# EAGLE design MaxAir_Smart_Home_Gateway_WT21-ET01_v202 (EAGLE 9.6.2)
MaxAir - Smart Heating, Ventilation and Air Conditioning (HVAC) Wi-Fi Smart Home Gateway based on MySensors library WT21ETH01 and nRF24L01 PA LNA Note: Power supplied by Barrel Jack connector with minimum 2amp for better performance. Power by micro USB isnt avaialble in this version. For more information on PiHome Smart Heating: http://www.pihome.eu
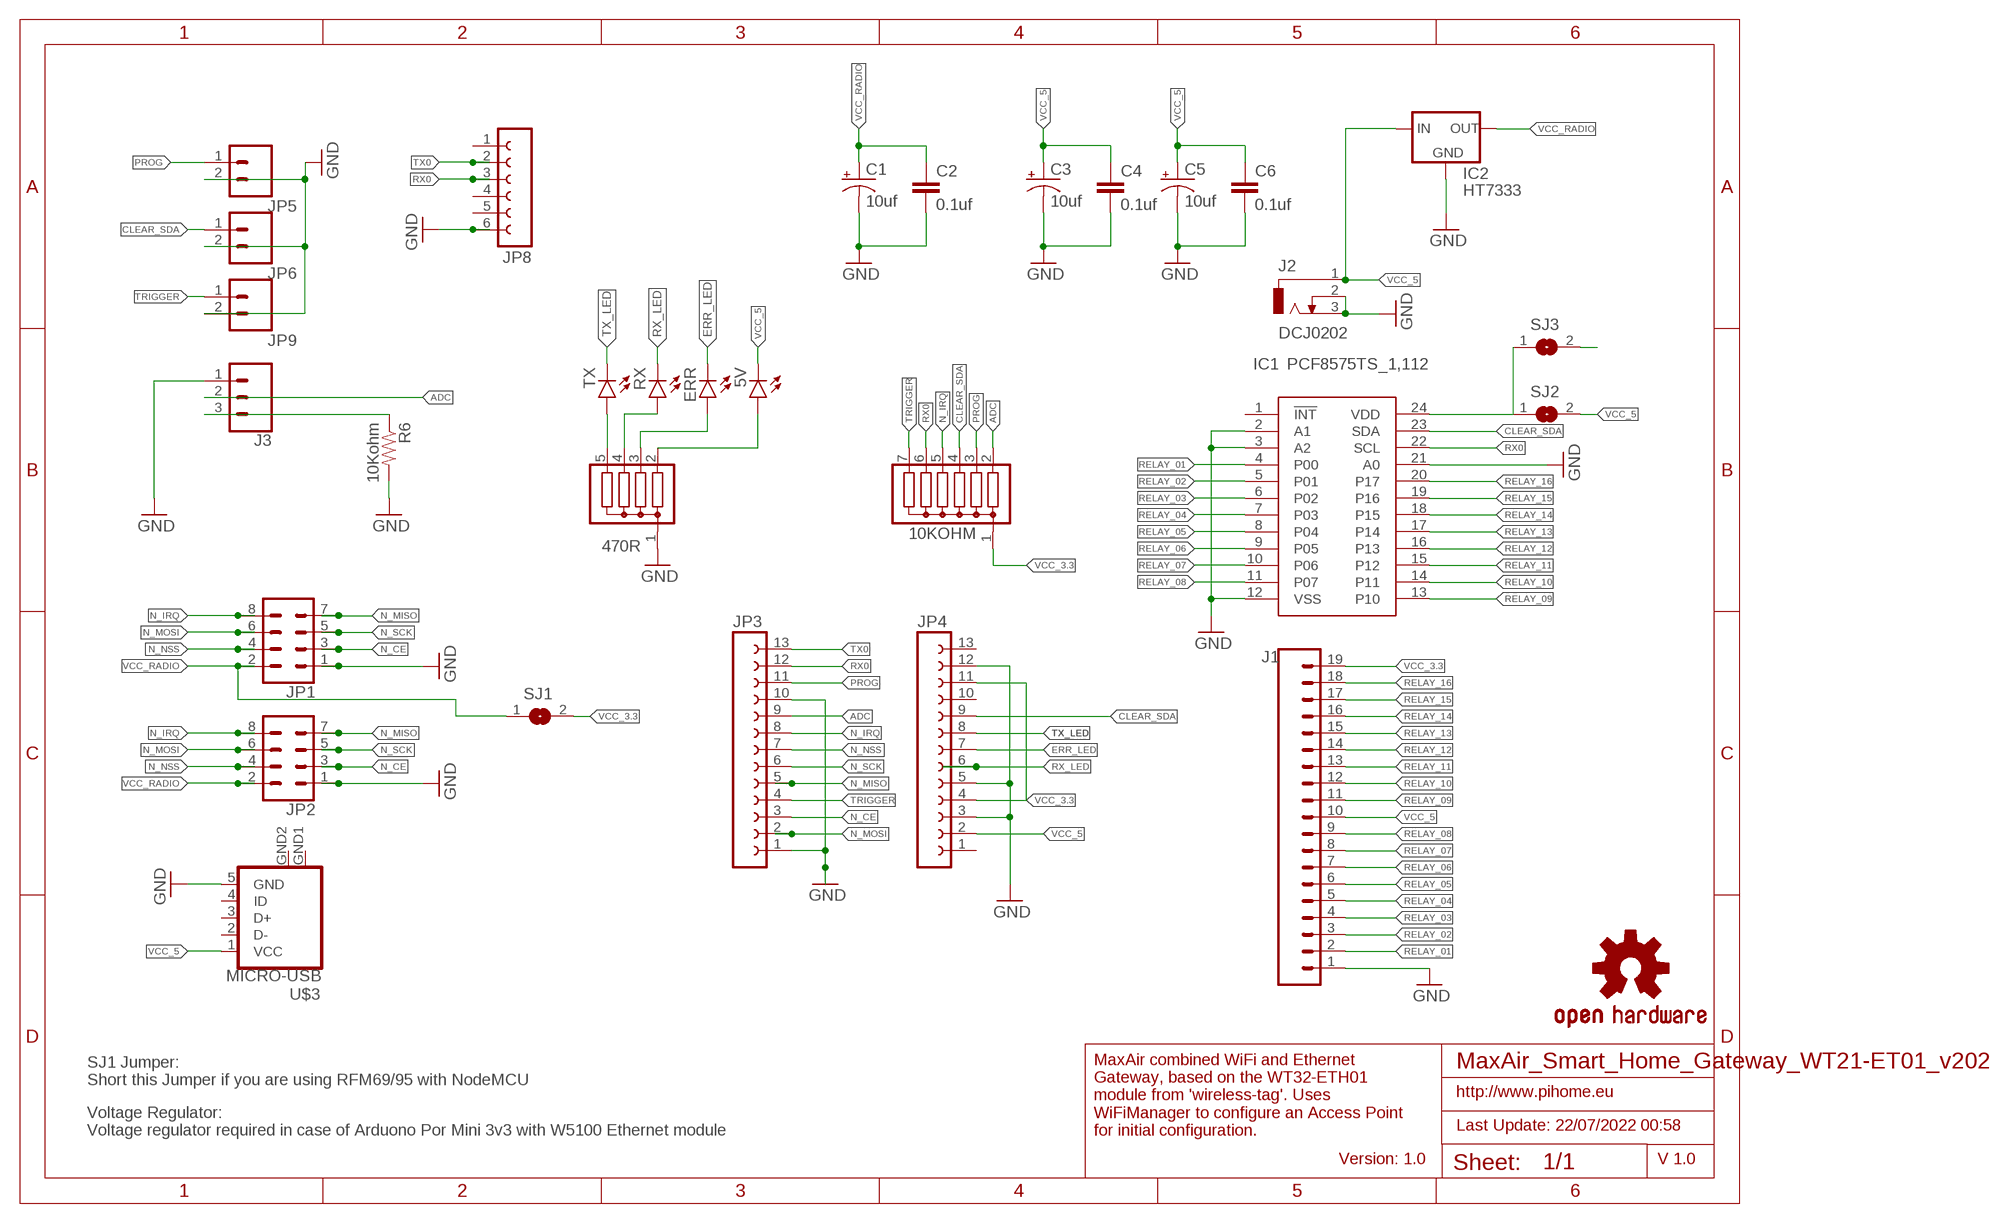
[diagram p0: schematic, sheet 1]

## Parts
5V  LED3MM  [LED3MM]
10KOHM  G06R  [SIL7]
470R  G04R  [SIL5]
C1  10uf  10UF-25V-20%(PTH)KIT  [CPOL-RADIAL-10UF-25V-KIT]
C2  0.1uf  0.1UF-50V-20%(PTH)KIT-EZ  [CAP-PTH-SMALL-KIT]
C3  10uf  10UF-25V-20%(PTH)KIT  [CPOL-RADIAL-10UF-25V-KIT]
C4  0.1uf  0.1UF-50V-20%(PTH)KIT-EZ  [CAP-PTH-SMALL-KIT]
C5  10uf  10UF-25V-20%(PTH)KIT  [CPOL-RADIAL-10UF-25V-KIT]
C6  0.1uf  0.1UF-50V-20%(PTH)KIT-EZ  [CAP-PTH-SMALL-KIT]
ERR  LED3MM  [LED3MM]
IC1  PCF8575TS_1,112  [SOP65P775X200-24N]
IC2  HT7333  [SOT-89]
J1  CONN_19  [1X19]
J2  DCJ0202  [DCJ0202]
J3  CONN_03  [1X03]
JP1  CONN_04X2  [2X4]
JP2  CONN_04X2  [2X4]
JP3  FE13-1  [FE13]
JP4  FE13-1  [FE13]
JP5  CONN_02  [1X02]
JP6  CONN_02  [1X02]
JP8  FE06-1  [FE06]
JP9  CONN_02  [1X02]
LOGO1  OSHW-LOGOMINI  [OSHW-LOGO-MINI]
R6  10Kohm  RESISTORAXIAL-0.3  [AXIAL-0.3]
RX  LED3MM  [LED3MM]
SJ1  SJ  [SJ]
SJ2  SJ  [SJ]
SJ3  SJ  [SJ]
TX  LED3MM  [LED3MM]
U$3  MICRO-USB  [MICRO-USB]

## Nets
8575: IC1.24(VDD) SJ2.1 SJ3.1
ADC: 10KOHM.2 J3.2 JP3.9
CLEAR_SDA: 10KOHM.4 IC1.23(SDA) JP4.9 JP6.1
DIS_ETH: J3.3 R6.P$1
ERR_LED: ERR.K(C) JP4.7
GND: 470R.1 C1.2(-) C2.2 C3.2(-) C4.2 C5.2(-) C6.2 IC1.2(A1) IC1.3(A2) IC1.12(VSS) IC1.21(A0) IC2.2(GND) J1.1 J2.2 J2.3 J3.1 JP1.1 JP2.1 JP3.1 JP3.10 JP4.3 JP4.5 JP4.12 JP5.2 JP6.2 JP8.6 JP9.2 R6.P$2 U$3.5(GND)
N$1: 470R.5 TX.A
N$2: 470R.4 RX.A
N$3: 470R.3 ERR.A
N$4: 5V.A 470R.2
N_CE: JP1.3 JP2.3 JP3.3
N_IRQ: 10KOHM.5 JP1.8 JP2.8 JP3.8
N_MISO: JP1.7 JP2.7 JP3.5
N_MOSI: JP1.6 JP2.6 JP3.2
N_NSS: JP1.4 JP2.4 JP3.7
N_SCK: JP1.5 JP2.5 JP3.6
PROG: 10KOHM.3 JP3.11 JP5.1
RELAY_01: IC1.4(P00) J1.2
RELAY_02: IC1.5(P01) J1.3
RELAY_03: IC1.6(P02) J1.4
RELAY_04: IC1.7(P03) J1.5
RELAY_05: IC1.8(P04) J1.6
RELAY_06: IC1.9(P05) J1.7
RELAY_07: IC1.10(P06) J1.8
RELAY_08: IC1.11(P07) J1.9
RELAY_09: IC1.13(P10) J1.11
RELAY_10: IC1.14(P11) J1.12
RELAY_11: IC1.15(P12) J1.13
RELAY_12: IC1.16(P13) J1.14
RELAY_13: IC1.17(P14) J1.15
RELAY_14: IC1.18(P15) J1.16
RELAY_15: IC1.19(P16) J1.17
RELAY_16: IC1.20(P17) J1.18
RX0: 10KOHM.6 IC1.22(SCL) JP3.12 JP8.3
RX_LED: JP4.6 RX.K(C)
TRIGGER: 10KOHM.7 JP3.4 JP9.1
TX0: JP3.13 JP8.2
TX_LED: JP4.8 TX.K(C)
VCC_3.3: 10KOHM.1 J1.19 JP4.4 JP4.11 SJ1.2 SJ3.2
VCC_5: 5V.K(C) C3.1(+) C4.1 C5.1(+) C6.1 IC2.3(IN) IC2.4(IN) J1.10 J2.1 JP4.2 SJ2.2 U$3.1(VCC)
VCC_RADIO: C1.1(+) C2.1 IC2.1(OUT) JP1.2 JP2.2 SJ1.1
Unconnected: IC1.1(!INT) JP4.1 JP4.10 JP4.13 JP8.1 JP8.4 JP8.5 U$3.2(D-) U$3.3(D+) U$3.4(ID)

## Notes on the sheet
- SJ1 Jumper:
  Short this Jumper if you are using RFM69/95 with NodeMCU
- http://www.pihome.eu
- Last Update: 22/07/2022 00:58
- Voltage Regulator:
  Voltage regulator required in case of Arduono Por Mini 3v3 with W5100 Ethernet module
- MaxAir combined WiFi and Ethernet
  Gateway, based on the WT32-ETH01
  module from 'wireless-tag'. Uses
  WiFiManager to configure an Access Point
  for initial configuration.
- Version: 1.0 | V 1.0

## Power pins joined to a net without a drawn wire
GND: U$3.GND1(GND) U$3.GND2(GND)

## Library data of the parts
5V ERR RX TX = SparkFun-LED:LED: LEDs Standard schematic elements and footprints for 5mm, 3mm, 1206, and 0603 sized LEDs. 5mm - Spark Fun Electronics SKU : COM-00529 (and others); PROD_ID: DIO-08794
10KOHM = resistor-sil:G06R: SIL RESISTOR; OC_FARNELL: unknown; OC_NEWARK: unknown
470R = resistor-sil:G04R: SIL RESISTOR; OC_FARNELL: unknown; OC_NEWARK: unknown
C1 C3 C5 = SparkFun-Capacitors:10UF-25V-20%(PTH): CAP-08440; PROD_ID: CAP-08440
C2 C4 C6 = SparkFun-Capacitors:0.1UF-50V-20%(PTH): CAP-08370; PROD_ID: CAP-08370
IC1 = PCF8575TS_1_112:PCF8575TS_1,112: I2C bus 16-bit I/O expander,PCF8575TSF1 NXP PCF8575TS/1,112, 16-channel I/O Expander 400kHz, I2C, 24-Pin SSOP Source: Datasheet <http://www.nxp.com/docs/en/data-sheet/PCF8575C.pdf>; ARROW_PART_NUMBER: PCF8575TS/1,112; ARROW_PRICE-STOCK: https://www.arrow.com/en/products/pcf8575ts1112/nxp-semiconductors?region=nac; DESCRIPTION: I2C bus 16-bit I/O expander,PCF8575TSF1 NXP PCF8575TS/1,112, 16-channel I/O Expander 400kHz, I2C, 24-Pin SSOP; HEIGHT: 2mm; MANUFACTURER_NAME: NXP; MANUFACTURER_PART_NUMBER: PCF8575TS/1,112; MOUSER_PART_NUMBER: 771-PCF8575TSDB; MOUSER_PRICE-STOCK: https://www.mouser.co.uk/ProductDetail/NXP-Semiconductors/PCF8575TS-1112?qs=LOCUfHb8d9vJzKldbVRCSg%3D%3D
IC2 = holtek2:HT73*
J1 = SparkFun-Connectors:CONN_19: Multi connection point. Often used as Generic Header-pin footprint for 0.1 inch spaced/style header connections On any of the 0.1 inch spaced packages, you can populate with these: Break Away Headers - Straight <https://www.sparkfun.com/products/116> (PRT-00116) Break Away Male Headers - Right Angle <https://www.sparkfun.com/products/553> (PRT-00553) Female Headers <https://www.sparkfun.com/products/115> (PRT-00115) Break Away Headers - Machine Pin <https://www.sparkfun.com/products/117> (PRT-00117) Break Away Female Headers - Swiss Machine Pin <https://www.sparkfun.com/products/743> (PRT-00743) For SCREWTERMINALS and SPRING TERMINALS visit here: Screw Terimnals on SparkFun.com <https://www.sparkfun.com/search/results?term=Screw+Terminals> (5mm/3.5mm/2.54mm spacing) This device is also useful as a general connection point to wire up your design to another part of your project. Our various solder wires solder well into these plated through hole pads. Hook-Up Wire - Assortment (Stranded, 22 AWG) <https://www.sparkfun.com/products/11375> (PRT-11375) Hook-Up Wire - Assortment (Solid Core, 22 AWG) <https://www.sparkfun.com/products/11367> (PRT-11367) View the entire wire category on our website here <https://www.sparkfun.com/categories/141> Special notes: Molex polarized connector foot print use with SKU : PRT-08231 with associated crimp pins and housings. 1MM SMD Version SKU: PRT-10208 NOTES ON THE VARIANTS LOCK and LOCK_LONGPADS... This footprint was designed to help hold the alignment of a through-hole component (i.e. 6-pin header) while soldering it into place. You may notice that each hole has been shifted either up or down by 0.005 of an inch from it's more standard position (which is a perfectly straight line). This slight alteration caused the pins (the squares in the middle) to touch the edges of the holes. Because they are alternating, it causes a "brace" to hold the component in place. 0.005 has proven to be the perfect amount of "off-center" position when using our standard breakaway headers. Although looks a little odd when you look at the bare footprint, once you have a header in there, the alteration is very hard to notice. Also,if you push a header all the way into place, it is covered up entirely on the bottom side.
J2 = con-jack:DCJ0202: DC POWER JACK Source: DCJ0202.pdf; OC_FARNELL: unknown; OC_NEWARK: unknown
J3 = SparkFun-Connectors:CONN_03: Multi connection point. Often used as Generic Header-pin footprint for 0.1 inch spaced/style header connections On any of the 0.1 inch spaced packages, you can populate with these: Break Away Headers - Straight <https://www.sparkfun.com/products/116> (PRT-00116) Break Away Male Headers - Right Angle <https://www.sparkfun.com/products/553> (PRT-00553) Female Headers <https://www.sparkfun.com/products/115> (PRT-00115) Break Away Headers - Machine Pin <https://www.sparkfun.com/products/117> (PRT-00117) Break Away Female Headers - Swiss Machine Pin <https://www.sparkfun.com/products/743> (PRT-00743) Stackable Header - 3 Pin (Female, 0.1") <https://www.sparkfun.com/products/13875> (PRT-13875) For SCREWTERMINALS and SPRING TERMINALS visit here: Screw Terimnals on SparkFun.com <https://www.sparkfun.com/search/results?term=Screw+Terminals> (5mm/3.5mm/2.54mm spacing) This device is also useful as a general connection point to wire up your design to another part of your project. Our various solder wires solder well into these plated through hole pads. Hook-Up Wire - Assortment (Stranded, 22 AWG) <https://www.sparkfun.com/products/11375> (PRT-11375) Hook-Up Wire - Assortment (Solid Core, 22 AWG) <https://www.sparkfun.com/products/11367> (PRT-11367) View the entire wire category on our website here <https://www.sparkfun.com/categories/141> Special notes: Molex polarized connector foot print use with SKU : PRT-08232 with associated crimp pins and housings.
JP1 JP2 = SparkFun-Connectors:CONN_04X2: Multi connection point. Often used as Generic Header-pin footprint for 0.1 inch spaced/style header connections On any of the 0.1 inch spaced packages, you can populate with these: Break Away Headers - Straight <https://www.sparkfun.com/products/116> (PRT-00116) Break Away Male Headers - Right Angle <https://www.sparkfun.com/products/553> (PRT-00553) Female Headers <https://www.sparkfun.com/products/115> (PRT-00115) Break Away Headers - Machine Pin <https://www.sparkfun.com/products/117> (PRT-00117) Break Away Female Headers - Swiss Machine Pin <https://www.sparkfun.com/products/743> (PRT-00743)
JP3 JP4 = con-lsta:FE13-1: FEMALE HEADER; OC_FARNELL: unknown; OC_NEWARK: unknown
JP5 JP6 JP9 = SparkFun-Connectors:CONN_02: Multi connection point. Often used as Generic Header-pin footprint for 0.1 inch spaced/style header connections On any of the 0.1 inch spaced packages, you can populate with these: Break Away Headers - Straight <https://www.sparkfun.com/products/116> (PRT-00116) Break Away Male Headers - Right Angle <https://www.sparkfun.com/products/553> (PRT-00553) Female Headers <https://www.sparkfun.com/products/115> (PRT-00115) Break Away Headers - Machine Pin <https://www.sparkfun.com/products/117> (PRT-00117) Break Away Female Headers - Swiss Machine Pin <https://www.sparkfun.com/products/743> (PRT-00743) For SCREWTERMINALS and SPRING TERMINALS visit here: Screw Terimnals on SparkFun.com <https://www.sparkfun.com/search/results?term=Screw+Terminals> (5mm/3.5mm/2.54mm spacing) This device is also useful as a general connection point to wire up your design to another part of your project. Our various solder wires solder well into these plated through hole pads. Hook-Up Wire - Assortment (Stranded, 22 AWG) <https://www.sparkfun.com/products/11375> (PRT-11375) Hook-Up Wire - Assortment (Solid Core, 22 AWG) <https://www.sparkfun.com/products/11367> (PRT-11367) View the entire wire category on our website here <https://www.sparkfun.com/categories/141> Special notes: Molex polarized connector foot print use with: PRT-08233 with associated crimp pins and housings. 2.54_SCREWTERM for use with PRT-10571. 3.5mm Screw Terminal footprints for PRT-08084 5mm Screw Terminal footprints for use with PRT-08432
JP8 = con-lsta:FE06-1: FEMALE HEADER; OC_FARNELL: unknown; OC_NEWARK: unknown
LOGO1 = SparkFun-Aesthetics@1:OSHW-LOGO: Open-Source Hardware (OSHW) Logo This logo indicates the piece of hardware it is found on incorporates a OSHW license and/or adheres to the definition of open source hardware found here: http://freedomdefined.org/OSHW
R6 = SparkFun-Passives:RESISTOR: Resistor Basic schematic elements and footprints for 0603, 1206, and PTH resistors.
SJ1-SJ3 = jumper:SJ: SMD solder JUMPER
U$3 = microusb:MICRO-USB: Micro USB B connector

## Net classes
0 default: width 0.254 mm, drill 0.076 mm, clearance 0.205 mm

## Board
MaxAir - Smart Heating, Ventilation and Air Conditioning (HVAC) Wi-Fi Smart Home Gateway based on MySensors library WT21ETH01 and nRF24L01 PA LNA Note: Power supplied by Barrel Jack connector with minimum 2amp for better performance. Power by micro USB isnt avaialble in this version. For more information on PiHome Smart Heating: http://www.pihome.eu
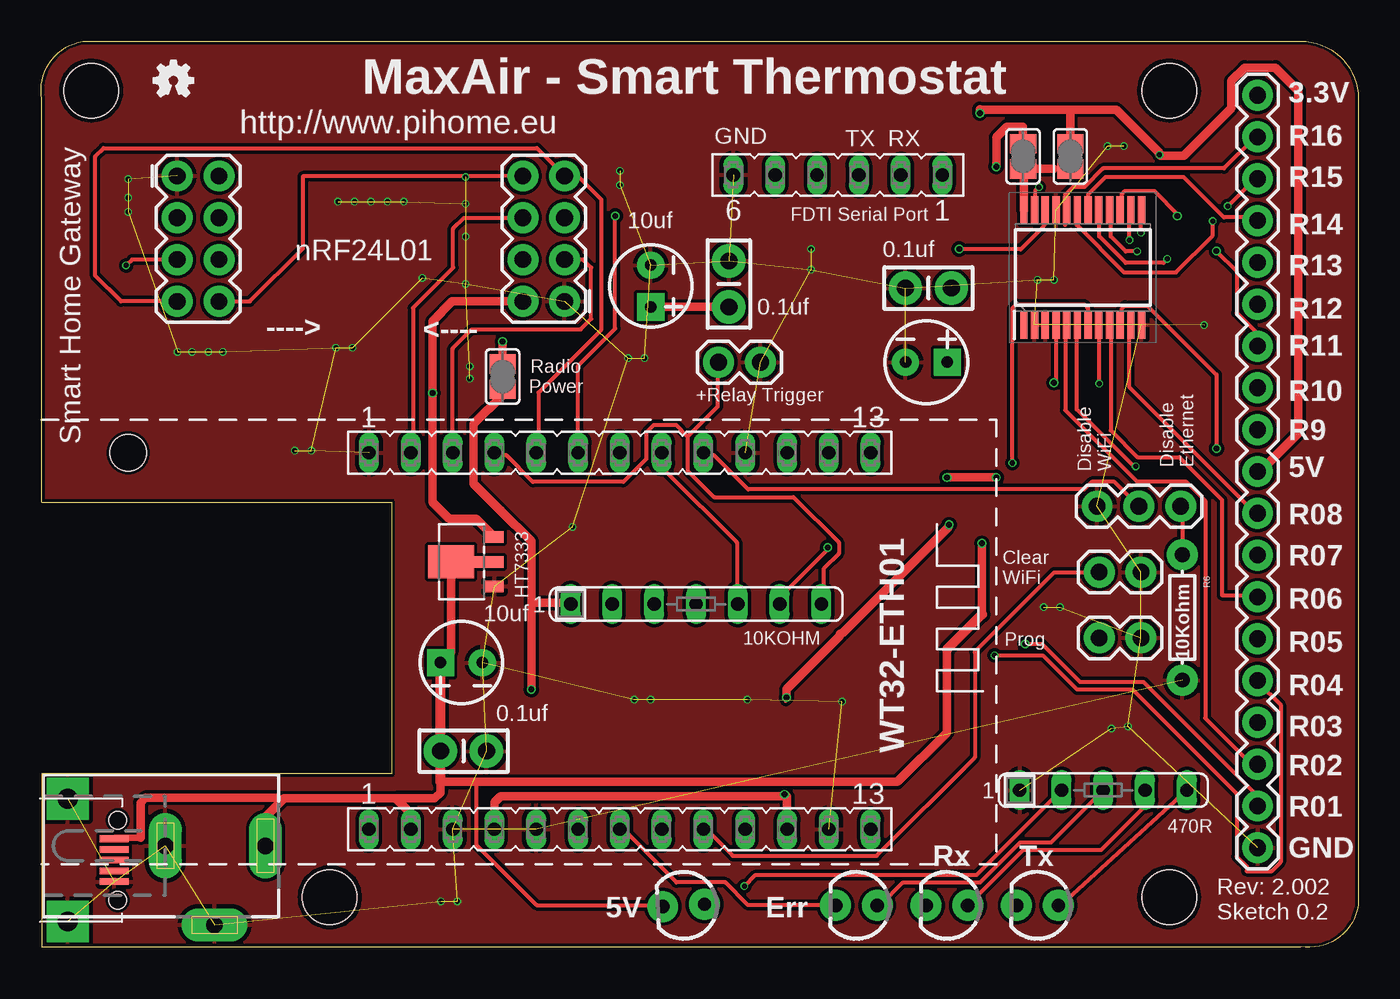
[diagram p1: board, top side]
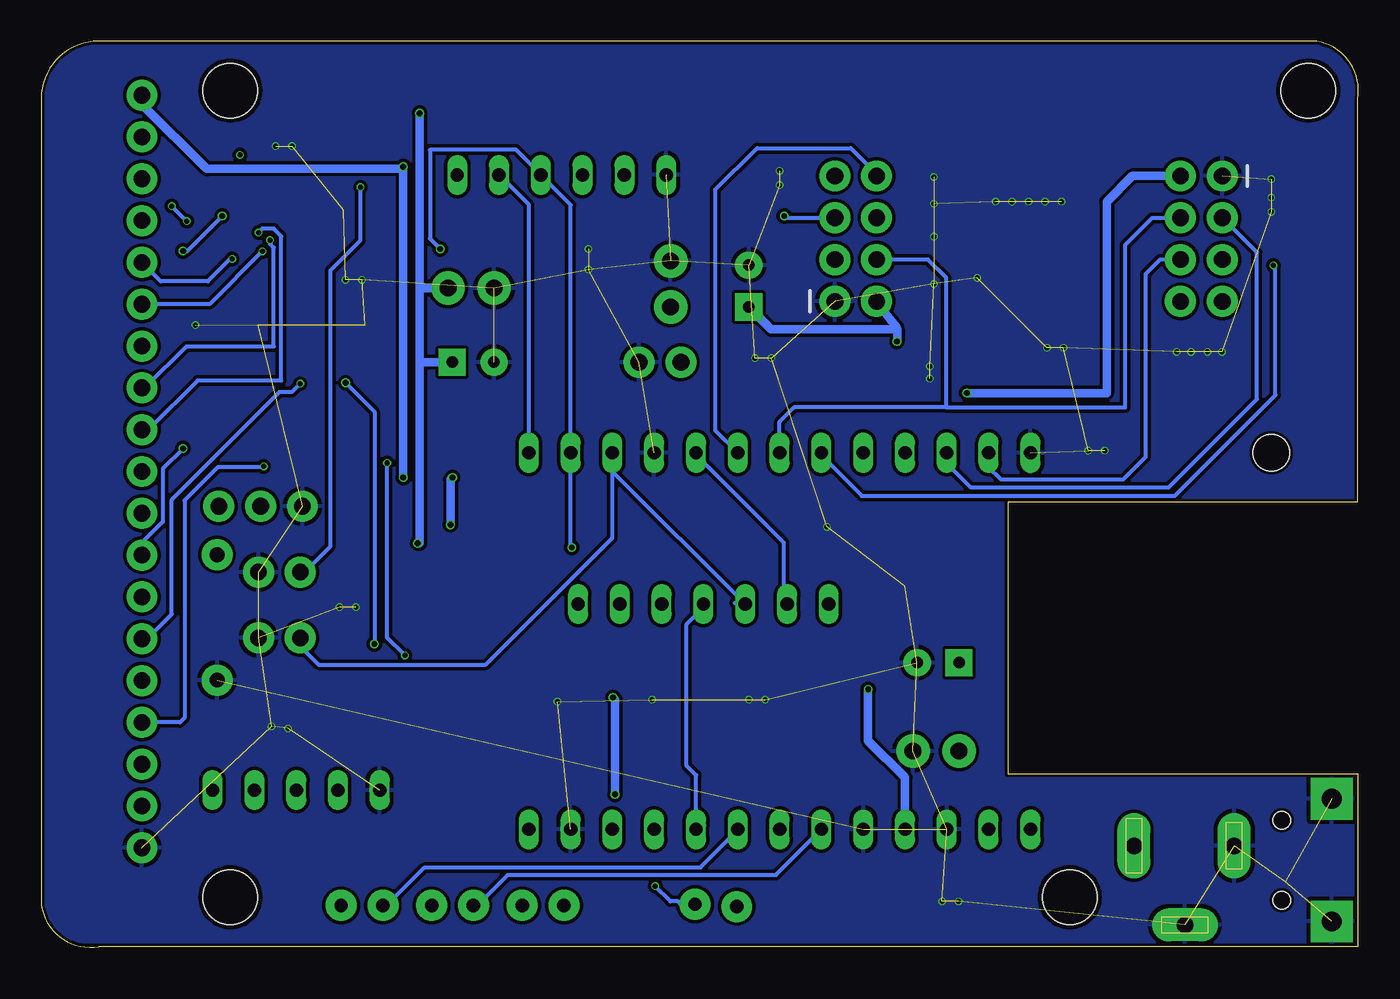
[diagram p2: board, bottom side, seen from below]

Size 80.04 x 55.04 mm. Coordinates in mm from the lower left corner, seen from the top.
Outline: 0.04,0.04 76.54,0.04 arc90 80.04,2.54 80.04,51.54 arc90 76.54,55.04 2.54,55.04 arc90 0.04,51.54 0.04,27.04 21.29,27.04 21.29,10.54 0.04,10.54 0.04,0.04
Copper layers (1*16): Top 0.035559375mm / dielectric 1.6mm / Bottom 0.035559375mm
Design rules "PiHome - JLCPCB 2 Layer": minimum track width 5mil, minimum drill 12mil, track to track 5mil, track to pad 5mil, pad to pad 5mil, via to via 5mil, smd to smd 5mil, copper to edge 8mil, drill to drill 6mil, minimum pad ring 5mil, minimum via ring 3mil, stop-mask expansion 2.5mil, vias tented up to drill 0mil, thermal gap 10mil
Holes 2.2 mm at 5.29,30.04

### Footprints (pad centres in the part's own frame; a part is rotated, then mirrored left to right if it is on the bottom)
LED3MM = drill 0.813 pad 1.88: A -1.27,0; K 1.27,0
SIL7 = drill 0.813 long: 1 -7.62,0; 2 -5.08,0; 3 -2.54,0; 4 0,0; 5 2.54,0; 6 5.08,0; 7 7.62,0
SIL5 = drill 0.813 long: 1 -5.08,0; 2 -2.54,0; 3 0,0; 4 2.54,0; 5 5.08,0
CPOL-RADIAL-10UF-25V-KIT = drill 0.7 pad 1.651 square: 1 1.27,0 | drill 0.7 pad 1.651: 2 -1.27,0
CAP-PTH-SMALL-KIT = drill 1.016 pad 2.032: 1 -1.397,0; 2 1.397,0
SOP65P775X200-24N = smd 1.675 x 0.45: 1 -3.488,3.575; 2 -3.488,2.925; 3 -3.488,2.275; 4 -3.488,1.625; 5 -3.488,0.975; 6 -3.488,0.325; 7 -3.488,-0.325; 8 -3.488,-0.975; 9 -3.488,-1.625; 10 -3.488,-2.275; 11 -3.488,-2.925; 12 -3.488,-3.575; 13 3.488,-3.575; 14 3.488,-2.925; 15 3.488,-2.275; 16 3.488,-1.625; 17 3.488,-0.975; 18 3.488,-0.325; 19 3.488,0.325; 20 3.488,0.975; 21 3.488,1.625; 22 3.488,2.275; 23 3.488,2.925; 24 3.488,3.575
SOT-89 = smd 0.7 x 1.1: 1 1.5,-2.385; 2 -1.5,-2.385 | smd 0.7 x 1.8: 3 0,-2.035 | smd 2 x 2.8: 4 0,0.265
1X19 = drill 1.016 pad 1.88: 1 0,0; 2 2.54,0; 3 5.08,0; 4 7.62,0; 5 10.16,0; 6 12.7,0; 7 15.24,0; 8 17.78,0; 9 20.32,0; 10 22.86,0; 11 25.4,0; 12 27.94,0; 13 30.48,0; 14 33.02,0; 15 35.56,0; 16 38.1,0; 17 40.64,0; 18 43.18,0; 19 45.72,0
DCJ0202 = drill 1 pad 2 long: 1 0,3.1; 2 4.8,0; 3 0,-3
1X03 = drill 1.016 pad 1.88: 1 0,0; 2 2.54,0; 3 5.08,0
2X4 = drill 1.016 pad 1.88: 1 -3.81,-1.27; 2 -3.81,1.27; 3 -1.27,-1.27; 4 -1.27,1.27; 5 1.27,-1.27; 6 1.27,1.27; 7 3.81,-1.27; 8 3.81,1.27
FE13 = drill 0.813 long: 1 -15.24,0; 2 -12.7,0; 3 -10.16,0; 4 -7.62,0; 5 -5.08,0; 6 -2.54,0; 7 0,0; 8 2.54,0; 9 5.08,0; 10 7.62,0; 11 10.16,0; 12 12.7,0; 13 15.24,0
1X02 = drill 1.016 pad 1.88: 1 0,0; 2 2.54,0
FE06 = drill 0.813 long: 1 -6.35,0; 2 -3.81,0; 3 -1.27,0; 4 1.27,0; 5 3.81,0; 6 6.35,0
AXIAL-0.3 = drill 0.9 pad 1.88: P$1 -3.81,0; P$2 3.81,0
SJ = smd 1.168 x 1.6: 1 -0.762,0; 2 0.762,0
STAND-OFF = hole 3.302: 0,0
MICRO-USB = smd 0.4 x 1.75: 1 -1.3,4.525; 2 -0.65,4.525; 3 0,4.525; 4 0.65,4.525; 5 1.3,4.525 | drill 1.2 pad 2.54 square: GND1 -3.725,1.7; GND2 3.725,1.7 | hole 1.05: -2.425,4.73; 2.425,4.73

### Placement (x,y rotation side)
5V  39.04,2.54 183.3 top
10KOHM  39.8,20.84 0 top
470R  64.54,9.54 0 top
C1  37.04,40.17 270 top
C2  41.79,40.29 90 top
C3  25.54,17.29 180 top
C4  25.67,11.92 0 top
C5  53.79,35.54 0 top
C6  53.92,40.04 180 top
ERR  49.54,2.54 180 top
IC1  63.29,41.29 90 top
IC2  25.17,23.42 90 top
J1  73.92,6.04 90 top
J2  10.54,6.17 270 top
J3  64.17,26.79 0 top
JP1  30.54,43.04 90 top
JP2  9.54,43.04 270 top
JP3  35.17,30.04 0 top
JP4  35.17,7.17 0 top
JP5  64.29,18.79 0 top
JP6  64.29,22.79 0 top
JP8  48.42,46.92 180 top
JP9  41.17,35.54 0 top
LOGO1  8.04,52.67 0 top
R6  69.35,20.04 270 top
RX  55.04,2.54 180 top
SJ1  28.04,34.67 270 top
SJ2  62.54,48.04 90 top
SJ3  59.67,48.04 90 top
TX  60.54,2.54 180 top
U$1  [STAND-OFF]  3.04,52.04 0 top
U$2  [STAND-OFF]  17.54,3.04 0 top
U$3  -0.08,5.29 270 top
U$4  [STAND-OFF]  68.54,52.04 0 top
U$5  [STAND-OFF]  68.54,3.04 0 top

### Tracks (layer width: path | path; a pad name or v marks a point on that pad's centre or on a via)
8575
  Top 0.254: SJ2.1 62.46,47.32 61.78,47.32 61.53,47.28
  Top 0.508: IC1.24 59.72,47.23 SJ3.1 61.53,47.28 61.54,47.29
ADC
  Top 0.254: J3.2 66.6,26.89 65.22,28.27 63.84,28.27 63.38,27.81 42.96,27.81 40.89,29.88 40.43,29.88 JP3.9 40.43,30.1
  Bottom 0.254: 10KOHM.2 34.92,20.92 34.92,24.6 40.2,29.88 JP3.9
CLEAR_SDA  (via drill 0.3)
  Top 0.254: v60.63,46.17 60.4,45.94 60.4,44.79 IC1.23 | JP4.9 40.43,7.15 42.04,5.55 50.76,5.55 56.73,11.52 56.73,17.94 61.55,22.76 64.07,22.76 JP6.1
  Bottom 0.254: 39.74,7.38 40.2,7.38 JP4.9 40.25,10.45 40.81,11.01 40.81,19.63 39.74,20.7 10KOHM.4 | v60.63,46.17 60.63,42.96 62.46,41.12 62.46,24.37 64.07,22.76 JP6.1
DIS_ETH
  Top 0.254: J3.3 69.35,26.68 R6.P$1
ERR_LED
  Top 0.254: JP4.7 35.38,7.15 38.6,3.94 41.58,3.94 42.96,2.57 48.24,2.57 ERR.K
GND  (via drill 0.3)  (75 unrouted)
  other vias: 8.29,36.17 9.17,36.17 10.17,36.17 11.04,36.17 18.92,36.42 17.92,36.42 26.04,34.54 26.04,35.29 15.42,30.17 16.42,30.17 5.29,46.67 5.29,45.54 5.29,44.67 32.29,25.54 48.67,14.92 42.92,15.04 61.92,20.67 60.92,20.67 46.79,42.42 46.79,41.17 22.04,45.29 18.04,45.29 19.04,45.29 20.04,45.29 21.04,45.29 35.67,35.79 36.67,35.79 24.29,2.79 25.29,2.79 25.79,40.29 25.79,43.17 23.17,40.67 25.79,45.17 25.79,46.79 35.17,47.17 35.17,46.29 61.54,40.54 60.54,40.54 66.04,13.42 65.04,13.29 70.67,37.79 64.79,48.67 65.79,48.67 36.04,15.04 37.04,15.04
  pour Top: 0.29,0.29 0.29,10.29 21.54,10.29 21.54,27.29 0.29,27.29 0.29,54.79 79.79,54.79 79.79,0.29
  pour Bottom: 0.29,0.29 79.79,0.29 79.79,54.79 0.29,54.79 0.29,27.29 21.54,27.29 21.54,10.29 0.29,10.29
N$1
  Top 0.254: 470R.5 62.01,2.59 62.01,2.57 TX.A
N$2
  Top 0.254: RX.A 59.69,5.92 64.42,5.92 67.08,8.58 470R.4
N$3
  Top 0.254: ERR.A 50.99,2.57 52.37,3.94 57.06,3.94 59.5,6.37 61.37,6.37 470R.3
N$4  (via drill 0.3)
  Top 0.254: v42.73,3.71 43.42,4.4 56.86,4.4 470R.2
  Bottom 0.254: v42.73,3.71 41.81,2.79 41.35,2.79 41.12,2.57 40.43,2.57 5V.A
N_CE
  Top 0.254: JP3.3 25.01,36.38 26.17,37.54 32.79,37.54 33.42,38.17 33.42,41.29 32.94,41.77 JP1.3
  Bottom 0.254: JP3.3 25.01,29.38 23.54,27.92 11.54,27.92 6.17,33.29 6.17,42.21 JP2.3
N_IRQ
  Top 0.254: JP2.8 12.69,39.23 15.92,42.46 15.92,46.83 28,46.83 JP1.8 | 10KOHM.5 42.27,20.92 42.27,24.6 37.91,28.96 37.91,29.88 JP3.8
  Bottom 0.254: JP1.8 29.27,46.98 30.84,48.54 36.54,48.54 39.08,46 39.08,31.42 JP3.8
N_MISO
  Top 0.254: JP3.5 30.21,30.17 30.21,33.69 34.04,37.52 34.04,45.42 32.61,46.85 JP1.7 30.12,48.54 3.79,48.54 3.29,48.04 3.29,40.79 4.85,39.23 JP2.7
N_MOSI
  Top 0.254: 22.54,30.04 JP3.2 22.59,30.17 22.59,38.84 25.04,41.29 25.04,43.67 25.69,44.31 JP1.6
  Bottom 0.254: JP2.6 12.06,41.77 12.94,40.9 12.94,29.77 14.29,28.42 21.72,28.42 22.47,29.17 JP3.2
N_NSS
  Bottom 0.254: JP3.7 35.17,31.92 34.29,32.79 25.04,32.79 | 25.04,32.79 25.04,40.67 26.15,41.77 JP1.4 | JP2.4 12.52,44.31 14.17,42.67 14.17,32.79 25.04,32.79
N_SCK  (via drill 0.3, 0.35)
  Top 0.254: JP2.5 5.52,41.77 v5.17,41.42 | JP3.6 32.63,35.33 34.87,37.58 v34.87,44.42 v34.88,44.42
  Bottom 0.254: v5.17,41.42 5.04,41.42 5.04,33.54 11.17,27.42 30.17,27.42 32.63,29.88 JP3.6 | v34.88,44.42 34.78,44.31 JP1.5
PROG
  Bottom 0.254: 45.25,29.96 JP3.11 45.33,24.87 53.03,17.17 63.17,17.17 64.29,18.29 JP5.1 | 45.25,29.96 44.95,29.66 | 37.91,20.92 37.45,20.92 10KOHM.3 45.25,28.83 45.25,29.96
RELAY_01  (via drill 0.35)
  Top 0.254: v59.79,18.42 60.84,18.42 63.13,16.12 66.97,16.12 73.92,9.18 J1.2 | IC1.4 61.67,34.42 v61.54,34.29
  Bottom 0.254: v59.79,18.42 59.79,32.54 v61.54,34.29
RELAY_02
  Top 0.254: IC1.5 62.23,37.68 62.23,32.63 66.6,28.27 69.58,28.27 70.73,27.12 70.73,13.93 73.53,11.12 J1.3
RELAY_03  (via drill 0.3)
  Top 0.254: v66.51,29.21 66.39,29.21 62.92,32.67 62.92,37.68 IC1.6
  Bottom 0.254: v66.51,29.21 66.53,29.19 69.29,29.19 71.33,27.14 71.33,13.94 71.61,13.66 J1.4
RELAY_04  (via drill 0.3)
  Top 0.254: IC1.7 63.61,37.91 63.61,38.83 63.38,39.06 59.25,39.06 59.02,38.82 v59.02,29.42 | J1.5 73.94,16.11 75.32,14.73 75.32,5.17 74.77,4.63 73.25,4.63 73.25,4.91 72.64,5.51 72.64,9.31 66.29,15.66 62.94,15.66 60.87,17.73 v57.94,17.73
  Bottom 0.254: v57.94,17.73 59.04,18.83 59.04,29.4 v59.02,29.42
RELAY_05  (via drill 0.3)
  Top 0.254: v64.3,34.24 64.3,37.68 IC1.8
  Bottom 0.254: v64.3,34.24 64.8,33.74 65.55,33.74 72.1,27.18 72.1,20.24 73.48,18.86 73.71,18.86 J1.6
RELAY_06
  Top 0.254: IC1.9 64.99,37.68 64.99,31.4 66.62,29.77 69.16,29.77 71.75,27.18 71.75,21.38 73.71,21.38 J1.7
RELAY_07  (via drill 0.35)
  Top 0.254: 65.66,37.71 IC1.10 65.66,37.9 65.66,38.78 65.85,38.97 67.23,38.97 71.42,34.78 v71.42,30.29
  Bottom 0.254: v71.42,30.29 72.64,29.06 72.64,25.83 73.92,24.56 J1.8
RELAY_08
  Top 0.254: IC1.11 66.14,37.68 66.14,34.01 73.71,26.43 J1.9
RELAY_09  (via drill 0.3)
  Top 0.254: v66.82,43.42 66.82,44.56 IC1.13
  Bottom 0.254: v66.82,43.42 66.6,43.65 65.91,43.65 65.45,43.19 65.45,34.42 70.54,34.42 73.48,31.48 73.71,31.48 J1.11
RELAY_10  (via drill 0.3)
  Top 0.254: v66.14,42.96 66.14,44.56 IC1.14
  Bottom 0.254: v66.14,42.96 66.14,42.73 65.91,42.5 65.91,36.49 71.23,36.49 73.71,34.01 J1.12
RELAY_11  (via drill 0.35)
  Top 0.254: IC1.15 65.66,44.87 65.66,45.75 65.85,45.95 67.63,45.95 69.04,44.54 v69.04,44.42 | v71.42,42.29 72.64,41.06 72.64,38.53 73.92,37.26 J1.13
  Bottom 0.254: v69.04,44.42 71.17,42.29 v71.42,42.29
RELAY_12  (via drill 0.3)
  Top 0.254: v66.6,42.27 65.91,42.27 64.99,43.19 64.99,44.56 IC1.16
  Bottom 0.254: v66.6,42.27 69.8,39.06 J1.14
RELAY_13  (via drill 0.3)
  Top 0.254: v68.43,41.81 68.2,41.58 65.91,41.58 64.3,43.19 64.3,44.56 IC1.17
  Bottom 0.254: v68.43,41.81 68.56,41.81 69.92,40.45 72.77,40.45 J1.15
RELAY_14
  Top 0.254: IC1.18 63.61,44.79 63.61,45.71 64.68,46.77 69.43,46.77 71.87,44.33 73.71,44.33 J1.16
RELAY_15  (via drill 0.3)
  Top 0.254: IC1.19 62.92,44.56 62.92,43.87 65.8,41 68.95,41 71.19,43.23 v71.19,44.1 | v72.1,45.02 73.71,46.63 J1.17
  Bottom 0.254: v71.19,44.1 v72.1,45.02
RELAY_16
  Top 0.254: 62.23,43.87 62.23,44.56 IC1.20 62.23,44.79 62.23,45.71 62.69,46.17 63.38,46.17 64.53,47.32 71.87,47.32 73.71,49.15 J1.18
RX0  (via drill 0.35)
  Top 0.254: v55.79,42.42 55.81,42.4 59.52,42.4 60.92,43.8 60.92,43.85 61.11,44.04 61.09,44.1 61.09,44.56 IC1.22 | 10KOHM.6 45.02,20.92 45.02,21.38 47.78,24.14 v47.79,24.29
  Bottom 0.254: v55.79,42.42 56.42,43.04 56.42,48.42 56.37,48.47 51.21,48.47 49.69,46.94 JP8.3 47.87,45.1 JP3.12 47.87,24.37 v47.79,24.29
RX_LED
  Bottom 0.254: JP4.6 35.38,4.4 51.68,4.4 53.74,2.34 RX.K
TRIGGER
  Top 0.254: 39.29,31.02 41.12,32.86 41.12,35.38 JP9.1 | 39.29,31.02 39.29,28.96 40.89,27.35 45.71,27.35 48.47,24.6 48.47,23.91 47.55,22.99 47.55,20.92 10KOHM.7 | 39.29,31.02 38.6,31.71 37.22,31.71 36.76,31.25 36.76,29.65 35.38,28.27 29.88,28.27 28.27,29.88 27.58,29.88 JP3.4
TX0
  Bottom 0.254: JP3.13 50.41,45.1 JP8.2
TX_LED
  Bottom 0.254: JP4.8 37.91,7.15 37.91,6.93 39.97,4.86 56.73,4.86 59.25,2.34 TX.K
VCC_3.3  (via drill 0.35)
  Top 0.254: 28.04,33.54 SJ1.2 | 45.02,9.17 45.02,9.22 v45.17,9.29 | 45.25,14.96 v45.29,15.17 | 48.69,19.09 48.54,19.04 | 32.17,20.92 10KOHM.1 | 55.12,25.51 v55.17,25.67
  Top 0.508: 28.04,33.54 26.29,31.79 26.29,28.17 27.93,26.52 | JP4.4 27.55,8.8 27.92,9.17 45.02,9.17 45.33,9.17 JP4.11 | v58.04,47.42 v58.03,47.42 58.03,49.2 58.68,49.85 59.67,49.85 SJ3.2 | 48.54,19.04 48.54,18.92 45.29,15.67 v45.29,15.17 | v55.04,28.54 v58.04,28.54 | 27.94,26.54 27.93,26.52 | 48.69,19.09 55.12,25.51 | v29.79,15.67 29.79,20.92 | 29.79,20.92 29.79,24.67 27.93,26.52 | 29.79,20.92 32.17,20.92
  Bottom 0.508: v58.04,47.42 58.04,47.28 | 58.04,47.28 v58.04,28.54 | v45.29,15.17 45.17,15.04 v45.17,9.29 | J1.19 73.92,51.22 69.97,47.28 58.04,47.28 | v29.79,15.67 v29.79,15.66 29.79,12.55 27.55,10.31 JP4.4 | v55.04,28.54 55.17,28.42 v55.17,25.67
VCC_5  (via drill 0.3, 0.35)
  Top 0.254: 27.04,23.54 IC2.3 27.12,23.45 25.06,23.45 IC2.4 25.04,23.54 | v67.96,48.13 68.02,48.07 | 26.43,10.04 26.43,6.24 30.1,2.57 37.68,2.57 5V.K
  Top 0.406: 4.97,6.59 U$3.1 4.52,6.67 6.04,6.67 | 14.59,8.87 14.38,9.07
  Top 0.508: 24.27,10.04 26.43,10.04 52.04,10.04 55.04,13.04 55.04,18.1 | IC2.4 24.9,17.92 C3.1 | 24.27,15.54 C4.1 24.27,9.39 23.92,9.04 21.54,9.04 | J2.1 13.64,7.92 14.59,8.87 14.77,9.04 21.54,9.04 | 21.54,9.04 22.47,8.12 | v57.17,24.54 57.17,20.23 | v67.96,48.13 67.96,48.26 65.33,50.88 62.54,50.88 | 62.54,50.88 57.04,50.88 v57.04,50.67 57.04,50.92 | SJ2.2 62.54,50.88 | J1.10 74.07,28.9 76.4,31.23 76.4,52.03 75,53.43 73.13,53.43 72.33,52.64 72.33,50.97 69.43,48.07 68.02,48.07 | 6.04,6.67 6.04,8.79 6.32,9.07 14.38,9.07
  Top 0.61: 24.27,10.04 24.27,15.54 C3.1 | 22.47,8.12 JP4.2 | 55.04,18.1 57.17,20.23
  Bottom 0.254: 56.92,35.54 56.96,35.61 57.04,35.61
  Bottom 0.508: v57.04,50.67 57.04,40.04 | C6.1 57.04,40.04 | C5.1 56.92,35.54 | 57.04,40.04 57.04,35.61 57.04,24.54 v57.17,24.54
VCC_RADIO  (via drill 0.35)
  Top 0.254: 27.54,25.04 IC2.1 | SJ1.1 28.04,35.54
  Top 0.406: C2.1
  Top 0.508: IC2.1 26.43,26.04 24.79,26.04 23.79,27.04 v23.79,33.67 23.79,38.04 24.98,39.23 JP1.2 | C1.1 C2.1 | v28.04,36.79 SJ1.1
  Bottom 0.406: 28.02,37.69 JP1.2
  Bottom 0.508: JP2.2 13.73,46.85 15.29,45.29 15.29,33.67 v23.79,33.67 | JP1.2 28.02,37.54 | 28.02,37.54 28.02,36.81 v28.04,36.79 | C1.1 35.69,37.54 28.02,37.54

### Text on the board
tPlace: MaxAir - Smart Thermostat | 3.3V | TX | RX | Smart Home Gateway | http://www.pihome.eu | R16 | R15 | R14 | nRF24L01 | 0.1uf | R13 | 0.1uf | R12 | ----> | <---- | R11 | Radio / Power | +Relay Trigger | R10 | R9 | Disable / WiFi | Disable / Ethernet | 5V | R08 | R07 | Clear / WiFi | R06 | Prog | R05 | 0.1uf | R04 | R03 | WT32-ETH01 | R02 | R01 | Rx | Tx | GND | 5V | Err | Rev: 2.002 / Sketch 0.2
tNames: GND | FDTI Serial Port